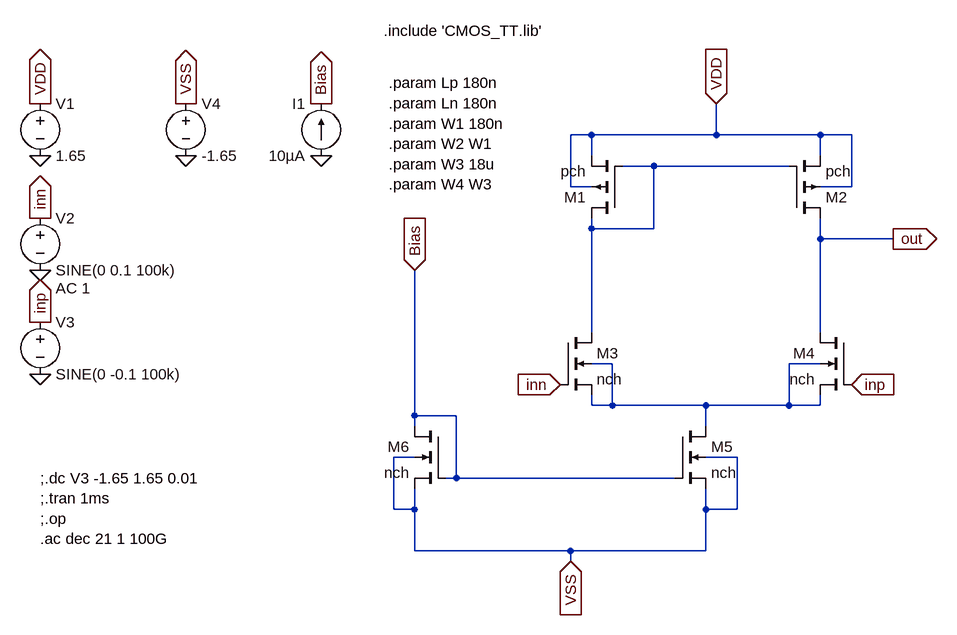
[diagram p0: schematic opamp_180n.asc]
opamp_180n.asc, the LTspice schematic file:
Version 4
SHEET 1 880 784
WIRE 48 0 16 0
WIRE 240 0 240 -48
WIRE 240 0 48 0
WIRE 400 0 240 0
WIRE 448 0 400 0
WIRE 48 32 48 0
WIRE 400 32 400 0
WIRE 144 48 96 48
WIRE 352 48 144 48
WIRE 16 80 16 0
WIRE 48 80 16 80
WIRE 448 80 448 0
WIRE 448 80 400 80
WIRE 48 144 48 128
WIRE 144 144 144 48
WIRE 144 144 48 144
WIRE 400 160 400 128
WIRE 512 160 400 160
WIRE 48 304 48 144
WIRE 400 304 400 160
WIRE 80 352 48 352
WIRE 400 352 352 352
WIRE 48 416 48 400
WIRE 80 416 80 352
WIRE 80 416 48 416
WIRE 224 416 80 416
WIRE 352 416 352 352
WIRE 352 416 224 416
WIRE 400 416 400 400
WIRE 400 416 352 416
WIRE -224 432 -224 208
WIRE -160 432 -224 432
WIRE -224 448 -224 432
WIRE 224 448 224 416
WIRE -224 496 -256 496
WIRE 272 496 224 496
WIRE -160 528 -160 432
WIRE -160 528 -176 528
WIRE 176 528 -160 528
WIRE -256 576 -256 496
WIRE -224 576 -224 544
WIRE -224 576 -256 576
WIRE 224 576 224 544
WIRE 272 576 272 496
WIRE 272 576 224 576
WIRE -224 640 -224 576
WIRE 16 640 -224 640
WIRE 224 640 224 576
WIRE 224 640 16 640
WIRE 16 656 16 640
FLAG 512 160 out
IOPIN 512 160 Out
FLAG -800 -48 VDD
IOPIN -800 -48 Out
FLAG 240 -48 VDD
IOPIN 240 -48 In
FLAG -800 32 0
FLAG -576 -48 VSS
IOPIN -576 -48 Out
FLAG 16 656 VSS
IOPIN 16 656 In
FLAG -800 128 inn
IOPIN -800 128 Out
FLAG 0 384 inn
IOPIN 0 384 In
FLAG -800 208 0
FLAG -800 288 inp
IOPIN -800 288 Out
FLAG 448 384 inp
IOPIN 448 384 In
FLAG -800 368 0
FLAG -368 32 0
FLAG -576 32 0
FLAG -368 -48 Bias
IOPIN -368 -48 Out
FLAG -224 208 Bias
IOPIN -224 208 In
DATAFLAG 224 432 "Id(M5)"
DATAFLAG -224 384 "Id(M6)"
DATAFLAG 48 272 "Id(M3)"
DATAFLAG 400 192 ""
SYMBOL pmos4 96 128 R180
SYMATTR InstName M1
SYMATTR Value pch
SYMATTR Value2 l={Lp} w={W1}
SYMBOL pmos4 352 128 M180
SYMATTR InstName M2
SYMATTR Value pch
SYMATTR Value2 l={Lp} w={W2}
SYMBOL nmos4 0 304 R0
SYMATTR InstName M3
SYMATTR Value nch
SYMATTR Value2 l={Ln} w={W3}
SYMBOL nmos4 448 304 M0
SYMATTR InstName M4
SYMATTR Value nch
SYMATTR Value2 l={Ln} w={W4}
SYMBOL nmos4 176 448 R0
SYMATTR InstName M5
SYMATTR Value nch
SYMATTR Value2 l=180n w=10u
SYMBOL nmos4 -176 448 M0
SYMATTR InstName M6
SYMATTR Value nch
SYMATTR Value2 l=180n w=1u
SYMBOL voltage -800 -64 R0
WINDOW 123 0 0 Left 0
WINDOW 39 0 0 Left 0
SYMATTR InstName V1
SYMATTR Value 1.65
SYMBOL voltage -800 112 R0
WINDOW 123 24 124 Left 2
WINDOW 39 0 0 Left 0
SYMATTR Value2 AC 1
SYMATTR InstName V2
SYMATTR Value SINE(0 0.1 100k)
SYMBOL voltage -800 272 R0
WINDOW 123 0 0 Left 0
WINDOW 39 0 0 Left 0
SYMATTR InstName V3
SYMATTR Value SINE(0 -0.1 100k)
SYMBOL voltage -576 -64 R0
WINDOW 123 0 0 Left 0
WINDOW 39 0 0 Left 0
SYMATTR InstName V4
SYMATTR Value -1.65
SYMBOL current -368 32 R180
WINDOW 0 24 80 Left 2
WINDOW 3 24 0 Left 2
WINDOW 123 0 0 Left 0
WINDOW 39 0 0 Left 0
SYMATTR InstName I1
SYMATTR Value 10µA
TEXT -272 -160 Left 2 !.include 'CMOS_TT.lib'
TEXT -800 528 Left 2 !;.dc V3 -1.65 1.65 0.01\n;.tran 1ms\n;.op\n.ac dec 21 1 100G
TEXT -264 -80 Left 2 !.param Lp 180n\n.param Ln 180n\n.param W1 180n\n.param W2 W1\n.param W3 18u\n.param W4 W3

The netlist it stands for:
* opamp_180n.asc
M1 N001 N001 VDD VDD pch l={Lp} w={W1}
M2 out N001 VDD VDD pch l={Lp} w={W2}
M3 N001 inn N002 N002 nch l={Ln} w={W3}
M4 out inp N002 N002 nch l={Ln} w={W4}
M5 N002 Bias VSS VSS nch l=180n w=10u
M6 Bias Bias VSS VSS nch l=180n w=1u
V1 VDD 0 1.65
V2 inn 0 SINE(0 0.1 100k) AC 1
V3 inp 0 SINE(0 -0.1 100k)
V4 VSS 0 -1.65
I1 0 Bias 10µA
.model NMOS NMOS
.model PMOS PMOS
.lib standard.mos
.include 'CMOS_TT.lib'
;.dc V3 -1.65 1.65 0.01
;.tran 1ms
;.op
.ac dec 21 1 100G
.param Lp 180n
.param Ln 180n
.param W1 180n
.param W2 W1
.param W3 18u
.param W4 W3
.backanno
.end